# EasyEDA Pro project stm32f103c8t6.eprj, board PCB1
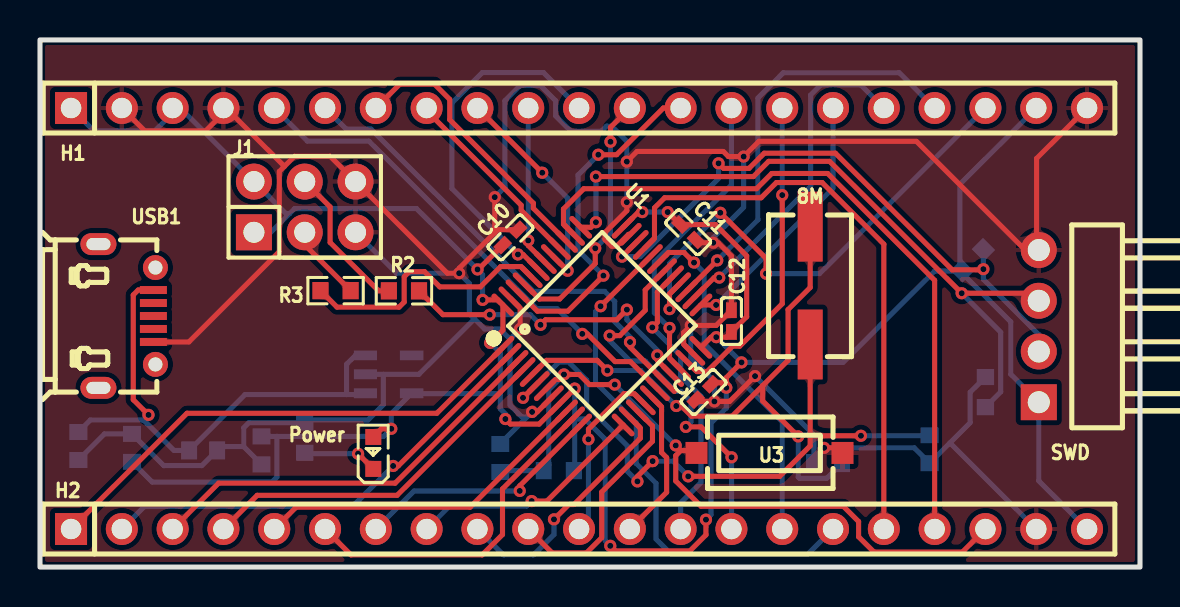
[diagram p2: board, top side]
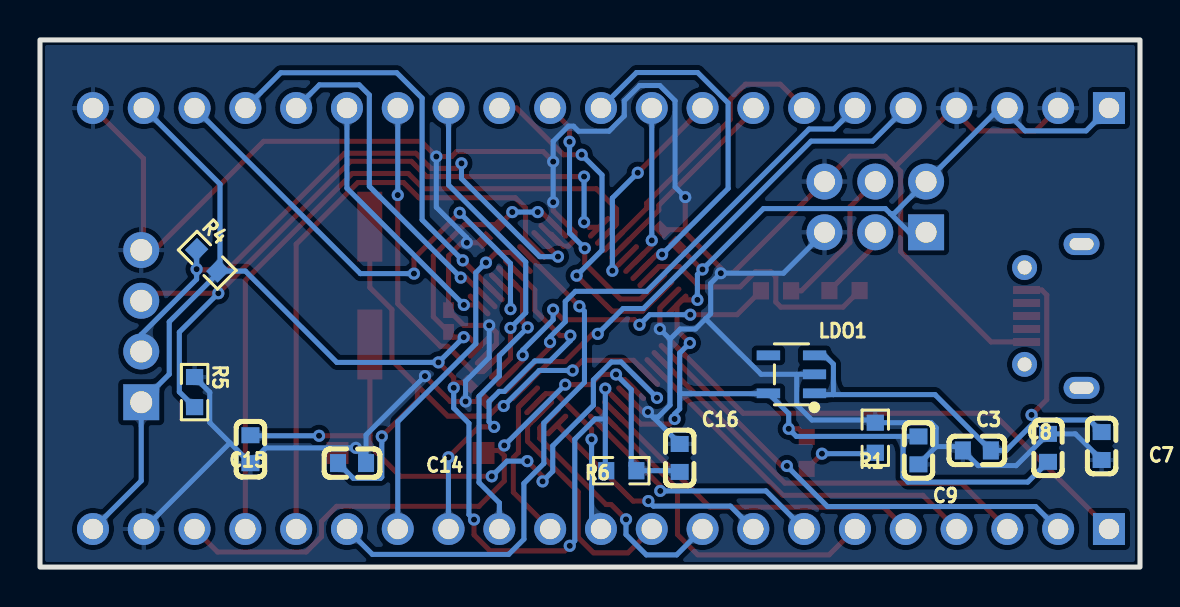
[diagram p3: board, bottom side, seen from below]

Outline 55 x 26.4 mm; copper layers: Top Layer, Bottom Layer. Coordinates in mm from the lower left corner of the outline.
Outline path: rectangle 0,26.4 55,0
Stack: Top Layer 0.035mm / Dielectric1 1.51mm FR4 er 4.5 / Bottom Layer 0.035mm

## Design rules (mm)
template: 自定义配置
spacing copperThickness1oz (default): track to track 0.102, other pairs 0.152 to 0.3
spacing copperThickness2oz: track to track 0.203, other pairs 0.152 to 0.3
track width copperThickness1oz (default): min 0.127, default 0.254, max 2.54
track width copperThickness2oz: min 0.203, default 0.254, max 2.54
differential pair differentialPair (default): width min 0.127, default 0.254, max 2.54; gap min 0.152, default 0.152
via viaSize (default): diameter min 0.5, default 0.61, max 10; hole min 0.3, default 0.305, max 6.3

## Placement (name value [footprint] x y rotation side)
8M  8MHz  [CRYSTAL-SMD_L7.0-W4.1-LS7.6]  38.51 14.1 90 top
C3  0.1UF  [C0603]  8.16 5.84 180 bottom
C7  1uF  [C0603]  1.92 6.06 90 bottom
C8  1uF  [C0603]  4.6 5.97 270 bottom
C9  0.1UF  [C0603]  11.08 5.84 90 bottom
C10  100nF  [C0402]  23.52 16.51 225 top
C11  100nF  [C0402]  32.41 16.76 135 top
C12  100nF  [C0402]  34.57 12.32 270 top
C13  100nF  [C0402]  33.18 8.76 45 top
C14  18pF  [C0603]  39.4 5.21 0 bottom
C15  18pF  [C0603]  44.48 5.9 90 bottom
C16  0.1UF  [C0603]  23.01 5.46 90 bottom
H1  HC-PZ254-11.5L-1x21PZ  [HDR-TH_21P-P2.54-V-M]  26.95 22.99 0 top
H2  HC-PZ254-11.5L-1x21PZ  [HDR-TH_21P-P2.54-V-M]  26.95 1.91 0 top
J1  2.54-2*3P针  [HDR-TH_6P-P2.54-V-M-R2-C3-S2.54-1]  13.24 18.03 0 top
LDO1  ME6211C33M5G-N  [SOT-23-5_L3.0-W1.7-P0.95-LS2.8-BL]  17.43 9.65 90 bottom
Power  NCD0603Y2  [LED0603-RD]  16.66 5.72 90 top
R1  1kΩ  [R0603]  13.24 6.48 90 bottom
R2  10kΩ  [R0603]  18.2 13.83 0 top
R3  10kΩ  [R0603]  14.78 13.84 0 top
R4  10kΩ  [R0603]  46.64 15.37 225 bottom
R5  10kΩ  [R0603]  47.27 8.76 270 bottom
R6  10kΩ  [R0603]  25.94 4.83 0 bottom
SWD  2541WR-04P  [HDR-TH_4P-P2.54-H-M-W10.4-N]  49.94 12.06 90 top
U1  STM32F103C8T6  [LQFP-48_L7.0-W7.0-P0.50-LS9.0-BL]  28.09 12.06 315 top
U3  KEYRESET  [SW-SMD_HX-TS-1101-C-W]  36.48 5.72 0 top
USB1  MICRO-USB-1  [MICRO-USB-SMD_C9900008946]  4.35 12.57 270 top

## Footprints (pads in the part's own frame, mm; a bottom-side part is the same pattern mirrored in y, then rotated)
C0402
  rect 0.79x0.54 smd: 1(-0.545,0) 2(0.545,0)
C0603
  rect 0.8x0.9 smd: 1(-0.7,0) 2(0.7,0)
CRYSTAL-SMD_L7.0-W4.1-LS7.6
  rect 3.5x1.25 smd: 1(-2.95,0) 2(2.95,0)
HDR-TH_4P-P2.54-H-M-W10.4-N
  rect 1.8x1.8 hole 1.1: 1(-3.81,0)
  round 1.8 hole 1.1: 2(-1.27,0) 3(1.27,0) 4(3.81,0)
HDR-TH_6P-P2.54-V-M-R2-C3-S2.54-1
  rect 1.8x1.8 hole 1.05: 1(-2.54,-1.27)
  round 1.8 hole 1.05: 2(-2.54,1.27) 3(0,-1.27) 4(0,1.27) 5(2.54,-1.27) 6(2.54,1.27)
HDR-TH_21P-P2.54-V-M
  rect 1.6x1.6 hole 1.02: 1(-25.4,0)
  round 1.6 hole 1.02: 2(-22.86,0) 3(-20.32,0) 4(-17.78,0) 5(-15.24,0) 6(-12.7,0) 7(-10.16,0) 8(-7.62,0) 9(-5.08,0) 10(-2.54,0) 11(0,0) 12(2.54,0) 13(5.08,0) 14(7.62,0) 15(10.16,0) 16(12.7,0) 17(15.24,0) 18(17.78,0) 19(20.32,0) 20(22.86,0) 21(25.4,0)
LED0603-RD
  rect 0.8x0.8 smd: 1(-0.799,0) 2(0.799,0)
LQFP-48_L7.0-W7.0-P0.50-LS9.0-BL
  oval 0.27x1.5 smd: 1(-2.75,-4.25) 2(-2.25,-4.25) 3(-1.75,-4.25) 4(-1.25,-4.25) 5(-0.75,-4.25) 6(-0.25,-4.25) 7(0.25,-4.25) 8(0.75,-4.25) 9(1.25,-4.25) 10(1.75,-4.25) 11(2.25,-4.25) 12(2.75,-4.25) 25(2.75,4.25) 26(2.25,4.25) 27(1.75,4.25) 28(1.25,4.25) 29(0.75,4.25) 30(0.25,4.25) 31(-0.25,4.25) 32(-0.75,4.25) 33(-1.25,4.25) 34(-1.75,4.25) 35(-2.25,4.25) 36(-2.75,4.25)
  oval 1.5x0.27 smd: 13(4.25,-2.75) 14(4.25,-2.25) 15(4.25,-1.75) 16(4.25,-1.25) 17(4.25,-0.75) 18(4.25,-0.25) 19(4.25,0.25) 20(4.25,0.75) 21(4.25,1.25) 22(4.25,1.75) 23(4.25,2.25) 24(4.25,2.75) 37(-4.25,2.75) 38(-4.25,2.25) 39(-4.25,1.75) 40(-4.25,1.25) 41(-4.25,0.75) 42(-4.25,0.25) 43(-4.25,-0.25) 44(-4.25,-0.75) 45(-4.25,-1.25) 46(-4.25,-1.75) 47(-4.25,-2.25) 48(-4.25,-2.75)
MICRO-USB-SMD_C9900008946
  rect 0.4x1.35 smd: 1(-1.3,1.325) 2(-0.65,1.325) 3(0,1.325) 4(0.65,1.325) 5(1.3,1.325)
  oval 1.1x1.8 hole 0.6x1.2: 6(-3.6,-1.425) 6(3.6,-1.425)
  round 1.25 hole 0.7: 6(-2.425,1.425) 6(2.425,1.425)
R0603
  rect 0.806x0.864 smd: 1(-0.753,0) 2(0.753,0)
SOT-23-5_L3.0-W1.7-P0.95-LS2.8-BL
  rect 0.49x1.157 smd: 1(-0.95,-1.153) 2(0,-1.153) 3(0.95,-1.153)
  rect 0.49x1.175 smd: 4(0.95,1.153) 5(-0.95,1.153)
SW-SMD_HX-TS-1101-C-W
  rect 1.1x1.1 smd: 1(-3.65,0) 2(3.65,0)

## Nets
As in the schematic, except:
GND: C3.1 C7.1 C8.1 C9.1 C10.1 C11.1 C12.1 C13.1 C14.1 C15.1 C16.2 H1.2 H1.4 H1.21 H2.20 J1.5 J1.6 LDO1.2 R1.2 R5.1 SWD.4 U1.8 U1.23 U1.35 U1.47 U3.2 USB1.5
VCC: C8.2 C9.2 C10.2 C11.2 C12.2 C13.2 H1.1 H1.3 H1.20 H2.21 J1.1 J1.2 LDO1.5 Power.2 R4.2 R6.2 SWD.1 U1.9 U1.24 U1.36 U1.48
OSCIN: 8M.2 C14.2 U1.5
OSOUT: 8M.1 C15.2 U1.6
SWCLK: R5.2 SWD.3 U1.37
SWIO: R4.1 SWD.2 U1.34
$1N2081: Power.1 R1.1

Pads without a net: LDO1 4; USB1 4 6

## Via types
v1: diameter 0.61, hole 0.305, Top Layer to Bottom Layer, 77 vias

## Routing (per net, layer and track width the routed paths; a pad name or vN(x,y) marks a point on that pad's centre or on a via; arc(x,y) is an arc through that point)
+5V: length 26.9
  Top Layer w0.254: USB1.1 4.91,13.87 4.66,13.63 4.66,8.38 v1(5.42,7.62)
  Bottom Layer w0.254: LDO1.3 15.77,10.6 15.33,10.16 15.33,8.64 ; 15.33,8.64 10.25,8.64 C3.2 6.69,5.84 5.17,7.37 ; 15.33,8.64 16.21,8.64 LDO1.1 ; 5.17,7.37 v1(5.42,7.62) ; 5.17,7.37 2.52,7.37 1.92,6.76
GND: length 187
  Top Layer w0.254: 22.74,16.75 20.96,14.97 v1(20.96,14.72) 20.37,14.72 J1.6 14.51,20.57 12.73,20.57 12.22,20.07 ; 22.74,16.75 22.89,16.9 C10.1 ; 22.74,16.75 v1(22.74,18.53) ; C13.1 32.88,8.29 v1(33.72,8.29) 34.48,8.29 v1(35.75,9.56) ; H1.21 49.83,20.46 49.83,15.98 ; 29.51,16.66 29.43,16.66 28.83,16.07 28.58,16.07 28.25,16.4 28.25,16.75 29.34,17.85 v1(29.34,18.27) ; U3.2 39.87,5.97 v1(39.21,5.97) ; v1(29.34,20.3) 29.85,20.81 34.17,20.81 34.42,20.56 v1(35.18,20.56) 35.94,21.32 43.82,21.32 49.15,15.98 49.83,15.98 ; 32.69,10.65 32.18,11.16 32.18,11.75 v1(32.54,12.1) 33.81,12.1 C12.1 34.57,15.58 33.91,16.24 v1(33.66,16.24) 32.94,16.24 C11.1 ; USB1.5 7.44,11.27 11.97,15.8 11.97,19.81 12.22,20.07 ; 9.3,22.86 H1.4 ; 9.3,22.86 8.28,21.84 5.23,21.84 H1.2 ; 9.3,22.86 9.43,22.86 12.22,20.07 ; U1.8 24.86,7.77 v1(24.6,7.77) ; 49.83,15.98 SWD.4 ; v1(24.01,11.92) 24.01,12.97 23.5,13.48
  Bottom Layer w0.254: 10.19,6.03 9.04,6.03 C3.1 8.09,5.08 6.19,5.08 C8.1 3.23,6.67 C7.1 ; 10.19,6.03 C9.1 ; 10.19,6.03 10.19,6.98 10.44,7.23 R1.2 13.37,7.37 16.4,7.37 17.17,8.13 17.17,9.65 ; v1(35.75,9.56) 38.7,6.62 38.7,5.6 ; 23.5,11.41 22.99,11.92 22.23,11.92 21.72,12.43 ; 23.5,11.41 23.5,8.11 24.1,7.51 24.35,7.51 ; 23.5,11.41 v1(24.01,11.92) ; J1.5 17.82,14.72 v1(20.96,14.72) 21.47,14.21 21.47,12.68 21.72,12.43 ; v1(22.74,18.53) 23.25,19.03 23.25,23.35 24.01,24.11 25.02,24.11 25.78,23.35 25.78,22.59 26.55,21.83 28.07,21.83 28.32,22.08 28.58,22.08 29.34,21.32 v1(29.34,20.3) v1(29.34,18.27) ; 17.17,9.65 18.94,9.65 21.72,12.43 ; 17.17,9.65 LDO1.2 ; v1(32.54,12.1) 32.54,10.49 33.72,9.31 v1(33.72,8.29) ; 38.7,5.6 38.84,5.6 v1(39.21,5.97) 43.71,5.97 C15.1 46.51,7.23 46.51,8.75 R5.1 ; 38.7,5.6 C14.1 ; 45.5,6.22 H2.20 ; C16.2 23.01,6.18 24.35,7.51 ; v1(33.66,16.24) 33.66,16.49 35.18,18.02 v1(35.18,20.56) ; v1(24.6,7.77) 24.35,7.51
VBAT: length 25.4
  Top Layer w0.254: H2.1 7.35,7.7 19.84,7.7 U1.1
VCC: length 146.6
  Top Layer w0.254: v1(22.51,11.22) 23.15,11.86 U1.48 22.89,13.38 v1(22.13,13.38) ; v1(33.3,2.38) 33.3,1.61 32.5,0.81 28.77,0.81 v1(28.51,1.06) ; U1.24 33.55,11.51 v1(33.81,11.51) 34.31,11.51 C12.2 35.33,12.54 35.33,15.58 33.77,17.15 C11.2 32.01,17.15 v1(31.38,17.78) ; v1(26.74,8.94) U1.9 24.96,7.16 23.52,7.16 v1(23.27,7.41) ; v1(17.56,6.92) 17.07,6.92 Power.2 ; v1(35.08,10.25) 34.31,9.49 34.31,9.23 ; U1.36 29.92,17.78 v1(30.12,17.78) ; C13.2 33.65,9.23 34.31,9.23 ; 34.31,9.23 v1(34.31,8.98) ; v1(21.88,14.9) 21.92,14.9 C10.2
  Bottom Layer w0.254: H1.1 2.69,21.84 5.74,21.84 6.76,22.86 ; v1(22.13,13.38) 22.13,14.65 v1(21.88,14.9) 18.83,17.95 12.73,17.95 12.48,17.7 ; 6.76,22.86 H1.3 ; 6.76,22.86 7.14,22.86 J1.2 12.3,17.7 12.48,17.7 ; 46,14.82 46,19.17 H1.20 ; 46,14.82 44.73,14.82 40.16,10.25 v1(35.08,10.25) v1(33.81,11.51) ; 46,14.82 R4.2 ; 46,14.82 48.54,12.28 48.54,9.66 SWD.1 49.94,4.32 H2.21 ; v1(23.27,7.41) 23.27,7.67 23.01,7.92 23.01,8.68 ; v1(34.31,8.98) 34.31,7.96 33.55,7.2 33.55,2.63 v1(33.3,2.38) ; 11.85,6.54 11.85,4.51 11.59,4.26 5.61,4.26 C8.2 ; 11.85,6.54 C9.2 ; 11.85,6.54 17.18,6.54 v1(17.56,6.92) 17.56,7.69 LDO1.5 18.6,8.68 23.01,8.68 ; J1.1 11.54,16.76 12.48,17.7 ; R6.2 26.74,4.87 26.74,7.41 ; 26.74,7.41 27.24,7.41 28.26,6.4 28.26,1.32 v1(28.51,1.06) ; 26.74,7.41 v1(26.74,8.94) ; 23.01,8.68 23.01,10.72 v1(22.51,11.22) ; v1(31.38,17.78) v1(30.12,17.78)
BOOT0: length 13.3
  Top Layer w0.254: R3.1 14.85,13.02 17.96,13.02 18.21,13.27 18.21,14.54 18.46,14.79 19.23,14.79 19.99,14.03 22.02,14.03 23.04,15.05 24.05,15.05 U1.44
BOOT1: length 15.7
  Top Layer w0.254: v1(29.34,12.89) 28.84,12.38 25.28,12.38 v1(25.03,12.13) ; v1(22.49,12.64) 20.15,12.64 R2.2 ; U1.20 30.87,10.35 v1(30.87,10.61)
  Bottom Layer w0.254: v1(22.49,12.64) 24.52,12.64 v1(25.03,12.13) ; v1(29.34,12.89) 29.34,12.38 30.87,10.86 v1(30.87,10.61)
OSCIN: length 30.5
  Top Layer w0.254: v1(37.91,6.54) 36.13,8.32 36.13,9.08 ; 36.13,9.08 34.61,7.56 32.58,7.56 32.07,8.07 v1(31.81,8.07) ; 36.13,9.08 37.4,10.35 37.4,12.89 38.51,14 8M.2 ; U1.5 25.32,10.35 27.86,10.35 v1(28.37,9.84)
  Bottom Layer w0.254: v1(28.37,9.84) 30.04,9.84 v1(31.81,8.07) ; v1(37.91,6.54) 37.91,4.51 37.98,4.44 39.34,4.44 C14.2
OSOUT: length 32.7
  Top Layer w0.254: v1(32.41,4.54) 36.98,4.54 38.51,6.07 38.51,6.58 ; 38.51,6.58 8M.1 ; 38.51,6.58 v1(41.05,6.58) ; v1(29.87,4.29) 29.87,4.54 v1(30.63,5.31) ; 24.91,9.24 v1(24.15,8.47)
  Bottom Layer w0.254: v1(29.87,4.29) 29.36,4.8 29.36,6.07 27.33,8.1 27.33,9.37 26.43,10.27 25.95,10.27 v1(24.15,8.47) ; v1(32.41,4.54) 31.65,5.31 v1(30.63,5.31) ; v1(41.05,6.58) 44.45,6.58 C15.2
PA0: length 17.1
  Top Layer w0.254: U1.10 21.5,3 12.8,3 H2.5
PA1: length 17.1
  Top Layer w0.254: H2.6 15.55,0.61 22.11,0.61 23.12,1.63 23.12,3.91 U1.11
PA2: length 12.5
  Top Layer w0.254: v1(23.99,3.81) 23.99,4.07 U1.12
  Bottom Layer w0.254: v1(23.99,3.81) 18.7,3.81 H2.7
PA3: length 12
  Top Layer w0.254: v1(24.58,3.31) 25.35,3.31 U1.13
  Bottom Layer w0.254: v1(24.58,3.31) 24.33,3.05 20.48,3.05 H2.8
PA4: length 12.8
  Top Layer w0.254: v1(25.7,2.39) 26.44,3.13 26.7,3.13 30.02,6.45 30.02,6.96 29.51,7.47
  Bottom Layer w0.254: H2.9 23.17,0.61 24.68,0.61 25.7,1.63 v1(25.7,2.39)
PA5: length 12.2
  Top Layer w0.254: U1.15 30.62,7.06 30.62,6.3 28.08,3.76 28.08,1.47 27.32,0.71 25.61,0.71 H2.10
PA6: length 8.9
  Top Layer w0.254: v1(27.42,6.4) 27.42,6.91 29.2,8.68 29.71,8.68 U1.16
  Bottom Layer w0.254: H2.11 27.42,2.38 v1(27.42,6.4)
PA7: length 7.7
  Top Layer w0.254: H2.12 31.33,3.75 31.33,5.48 31.08,5.74 31.08,8.02 U1.17
PA8: length 14.5
  Top Layer w0.254: v1(30.61,12) 30.87,12.25 30.87,13.78 U1.29
  Bottom Layer w0.254: v1(30.61,12) 32.03,10.58 32.03,9.57 33.05,8.55 33.05,4.23 32.03,3.22 H2.13
PA9: length 18.2
  Top Layer w0.254: v1(34.58,5.5) 33.06,7.02 v1(32.29,7.02) ; U1.30 30.26,13.88 30.26,12.86 28.99,11.59 v1(28.48,11.59)
  Bottom Layer w0.254: v1(32.29,7.02) 32.55,7.27 32.55,8.29 32.04,8.8 31.78,8.8 30.26,10.32 29.5,10.32 28.48,11.34 v1(28.48,11.59) ; v1(34.58,5.5) 34.58,1.91
PA10: length 17.4
  Top Layer w0.254: v1(32.7,15.25) 32.19,15.75 31.43,15.75 30.92,15.25
  Bottom Layer w0.254: H2.15 37.11,7.28 33.21,11.18 33.21,14.74 v1(32.7,15.25)
PA11: length 26.3
  Top Layer w0.254: U1.32 v1(28.03,13.06)
  Bottom Layer w0.254: H2.16 38.38,0.64 31.57,0.64 30.8,1.4 30.8,4.19 29.81,5.19 29.81,7.22 27.78,9.25 27.78,12.81 v1(28.03,13.06)
PA12: length 29.8
  Top Layer w0.254: U1.33 30.72,16.46 30.72,17.99 31.23,18.49 36.06,18.49 36.82,19.26 39.11,19.26 42.19,16.17 H2.17
PA15: length 35.4
  Top Layer w0.254: 26.68,16.66 26.17,17.17 26.17,17.93 27.19,18.95 35.82,18.95 36.59,19.71 39.38,19.71 44.73,14.36 H2.18
PB0: length 25.1
  Top Layer w0.254: v1(27.11,11.68) 27.37,11.68 28.76,10.29 29.52,10.29 U1.18
  Bottom Layer w0.254: v1(27.11,11.68) 25.84,12.95 24.83,12.95 16.45,21.33 13.37,21.33 H1.5
PB1: length 23.6
  Top Layer w0.254: v1(29.5,11.27) 29.5,11.01 U1.19
  Bottom Layer w0.254: v1(29.5,11.27) 29.5,11.52 28.74,12.28 28.74,13.3 28.23,13.81 24.67,13.81 16.54,21.94 15.3,21.94 H1.6
PB3: length 14
  Top Layer w0.254: U1.39 24.67,17.97 24.67,18.22 20.49,22.4 20.49,23.42 19.72,24.18 17.99,24.18 H1.7
PB4: length 9.8
  Top Layer w0.254: U1.40 24.06,17.87 24.06,18.12 19.33,22.85 H1.8
PB5: length 11.1
  Top Layer w0.254: U1.41 v1(26.38,14.84) ; v1(25.11,19.75) H1.9
  Bottom Layer w0.254: v1(25.11,19.75) 26.38,18.48 v1(26.38,14.84)
PB6: length 8.1
  Top Layer w0.254: v1(24.41,16.36) 24.41,16.1 25.27,15.25
  Bottom Layer w0.254: v1(24.41,16.36) H1.10
PB7: length 18
  Top Layer w0.254: v1(23.9,15.66) 24.15,15.66 24.91,14.89
  Bottom Layer w0.254: H1.11 25.17,24.77 22.12,24.77 20.59,23.24 20.59,18.96 v1(23.9,15.66)
PB8: length 13.1
  Top Layer w0.254: U1.45 24.97,13.42 25.98,13.42 27.76,15.2 v1(27.76,15.96) ; H1.12 28.52,22.02 v1(28.52,21.3)
  Bottom Layer w0.254: v1(27.76,15.96) 28.52,16.73 v1(28.52,21.3)
PB9: length 17.6
  Top Layer w0.254: v1(28.17,14.59) 26.39,12.82 24.87,12.82 U1.46 ; v1(27.92,20.65) 28.83,20.65 31.17,22.99 H1.13
  Bottom Layer w0.254: v1(27.92,20.65) 26.9,19.63 26.9,15.86 v1(28.17,14.59)
PB10: length 15.2
  Top Layer w0.254: v1(31.48,11.98) 31.48,10.45 U1.21
  Bottom Layer w0.254: v1(31.48,11.98) 30.71,12.74 30.71,15.28 34.57,19.14 H1.14
PB11: length 16.2
  Top Layer w0.254: U1.22 32.85,9.79 33.35,9.79 34.62,11.06 34.99,11.06 37.11,13.19 v1(37.11,18.63)
  Bottom Layer w0.254: v1(37.11,18.63) H1.15
PB12: length 13
  Top Layer w0.254: U1.25 v1(33.81,13.13)
  Bottom Layer w0.254: v1(33.81,13.13) 39.65,18.97 H1.16
PB13: length 17.1
  Top Layer w0.254: v1(33.96,14.5) 33.71,14.5 U1.26
  Bottom Layer w0.254: H1.17 41.03,24.15 39.04,24.15 38.53,23.64 38.53,19.07 v1(33.96,14.5)
PB14: length 21.2
  Top Layer w0.254: U1.27 v1(33.86,15.36)
  Bottom Layer w0.254: H1.18 42.96,24.75 37.16,24.75 35.89,23.48 35.89,17.39 v1(33.86,15.36)
PB15: length 25.8
  Top Layer w0.254: v1(36.3,14.69) 36.3,15.46 v1(34.02,17.74) ; U1.28 31.48,13.68 v1(31.48,12.92)
  Bottom Layer w0.254: v1(34.02,17.74) 31.48,15.2 v1(31.48,12.92) ; v1(36.3,14.69) 38.98,14.69 H1.19
PC13: length 23
  Top Layer w0.254: v1(17.66,5.06) 17.91,5.06 23.5,10.65
  Bottom Layer w0.254: H2.2 5.22,3.03 15.62,3.03 v1(17.66,5.06)
PC14: length 20.7
  Top Layer w0.254: H2.3 8.93,4.2 17.76,4.2 U1.3
PC15: length 18.4
  Top Layer w0.254: U1.4 17.86,3.59 10.86,3.59 H2.4
RESET: length 36.4
  Top Layer w0.254: v1(31.79,6.09) 32.04,5.83 ; 32.04,5.83 32.71,5.83 U3.1 ; 32.04,5.83 31.79,5.58 31.79,4.31 33.06,3.04 40.17,3.04 40.93,2.28 40.93,1.52 41.69,0.75 46.12,0.75 H2.19 ; v1(28.74,9.14) 27.47,9.14 26.96,9.64 v1(26.2,9.64) 25.94,9.39 25.77,9.39 U1.7
  Bottom Layer w0.254: v1(26.2,9.64) 25.44,8.88 25.44,5.08 R6.1 23.08,4.83 C16.1 ; v1(28.74,9.14) v1(31.79,6.09)
SWCLK: length 35.3
  Top Layer w0.254: v1(27.8,19.55) 35.67,19.55 36.43,20.32 39.48,20.32 v1(46.08,13.71) 49.56,13.71 SWD.3 ; v1(27.8,17.27) 27.54,17.01 U1.37
  Bottom Layer w0.254: v1(46.08,13.71) 48.03,11.76 48.03,8.77 R5.2 ; v1(27.8,17.27) v1(27.8,19.55)
SWIO: length 30.6
  Top Layer w0.254: v1(33.93,20.22) 34.18,19.96 35.45,19.96 36.21,20.73 39.77,20.73 45.61,14.88 47.13,14.88 v1(47.17,14.92) ; U1.34 v1(29.1,15.55)
  Bottom Layer w0.254: SWD.2 49.94,11.64 47.17,14.41 v1(47.17,14.92) R4.1 ; v1(33.93,20.22) 33.93,19.46 30.02,15.55 v1(29.1,15.55)
$1N2081: length 3.8
  Top Layer w0.254: Power.1 v1(15.9,5.68)
  Bottom Layer w0.254: v1(15.9,5.68) 13.28,5.68 R1.1
$1N3316: length 3.9
  Top Layer w0.254: J1.3 13.24,16.14 15.53,13.84
$1N3320: length 7.5
  Top Layer w0.254: R2.1 16.93,13.83 14.51,16.26 14.51,18.03 J1.4

## Copper pours and planes (outline as drawn; the poured copper is in the pictures)
GND on Top Layer: -1.11,26.54 61.37,26.54 61.37,-1.02 -1.11,-1.02
GND on Top Layer: -1.11,26.54 61.37,26.54 61.37,-1.02 -1.11,-1.02
GND on Bottom Layer: -1.11,26.54 61.37,26.54 61.37,-0.89 -1.11,-0.89
GND on Bottom Layer: -1.11,26.54 61.37,26.54 61.37,-0.89 -1.11,-0.89

Small or netless copper shapes (teardrops, artwork), in the pictures only: 126 on Top Layer, 139 on Bottom Layer
